# Altium schematic sheet 关键回路分图.SchDoc
size A4
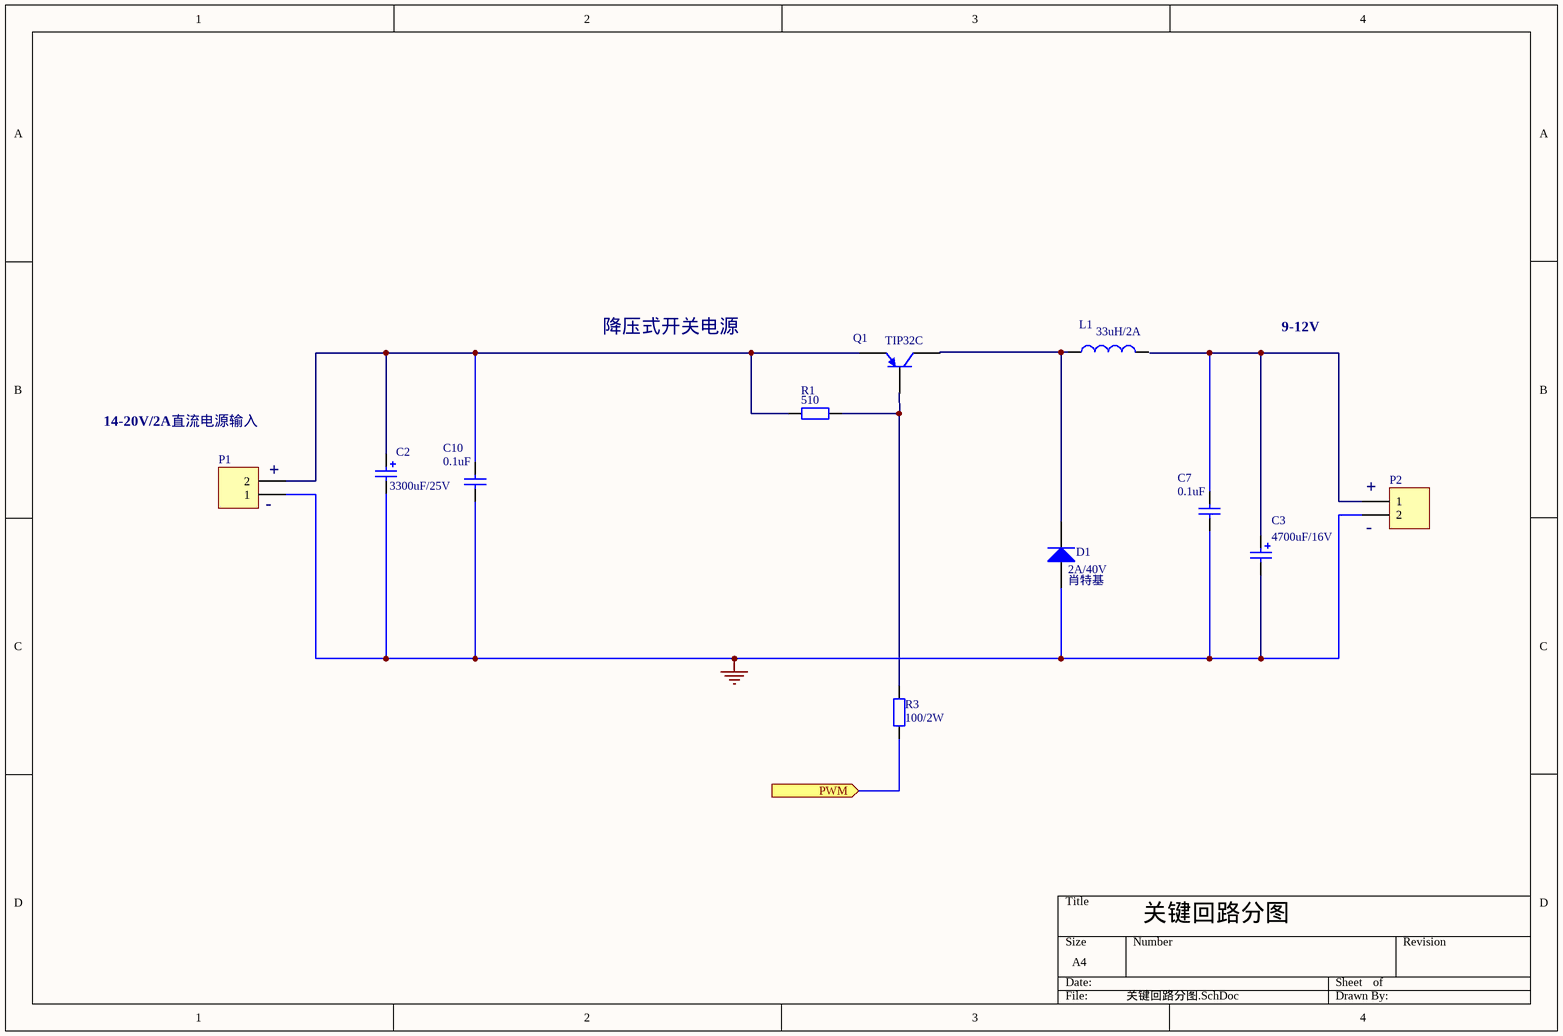
[diagram p0: 关键回路分图.SchDoc]

## Parts
C2  value 3300uF/25V  [3300电解电容]  (hidden comment: Cap Pol2)
C3  value 4700uF/16V  [4700电解电容]  (hidden comment: Cap Pol2)
C7  value 0.1uF  [瓷片电容]  (hidden comment: Cap)
C10  value 0.1uF  [瓷片电容]  (hidden comment: Cap)
D1  2A/40V  [肖特基]
L1  value 33uH/2A  [电感实物]  (hidden comment: Inductor)
P1  Header 2  [HDR1X2]  (value not drawn)
P2  Header 2  [HDR1X2]  (value not drawn)
R1  value 510  [AXIAL-0.4]  (hidden comment: Res2)
R3  value 100/2W  [AXIAL-0.4]  (hidden comment: Res2)
TIP32C  Q1  [TO-220-AB]

## Ports
PWM (in)

## Nets
GND: C2.2 C3.2 C7.1 C10.1 D1.1(A) P1.1 P2.2
PWM: R3.1 ; port PWM
NetC2_1: C2.1 C10.2 P1.2 R1.1 TIP32C.3(E)
NetC3_1: C3.1 C7.2 P2.1
NetD1_2: D1.2(K) L1.1
NetR1_2: R1.2 R3.2

Not connected (* = marked no-connect by the designer): L1 2; TIP32C 1(C) 2(B)

## Notes on the sheet
- 降压式开关电源
- 9-12V
- 14-20V/2A直流电源输入
- (near P1) -
- (near P1) +
- (near P2) +
- (near P2) -
- 关键回路分图

## Library data of the parts
C2 C3 = Cap Pol2: Polarized Capacitor (Axial); Published: 8-Jun-2000; LatestRevisionDate: 17-Jul-2002; LatestRevisionNote: Re-released for DXP Platform.; PackageReference: POLAR0.8; Publisher: Altium Limited
C7 C10 = Cap: Capacitor; Published: 8-Jun-2000; LatestRevisionDate: 17-Jul-2002; LatestRevisionNote: Re-released for DXP Platform.; PackageReference: RAD-0.3; Publisher: Altium Limited; PackageDescription: Radial Cap, Thru-Hole; 2 Leads; 0.3 in Pin Spacing
D1 = Diode: Default Diode; Published: 8-Jun-2000; LatestRevisionDate: 17-Jul-2002; LatestRevisionNote: Re-released for DXP Platform.; PackageVersion: Sep-1996; PackageReference: 肖特基; Publisher: Altium Limited; PackageDescription: DO-214-AB/SMC; 2 C-Bend Leads; Body 7.9 x 5.9 mm, inc. leads (LxW); Code_JEDEC: DO-214-AB
L1 = Inductor: Code_IEC: 1005; Published: 8-Jun-2000; LatestRevisionDate: 29-May-2009; LatestRevisionNote: IPC-7351 Footprint Added.; PackageReference: 0402-A; Publisher: Altium Limited; PackageDescription: Chip Inductor; Code_JEITA: 0402
P1 P2 = Header 2: Header, 2-Pin; LatestRevisionDate: 17-Jul-2002; LatestRevisionNote: Re-released for DXP Platform.; Publisher: Altium Limited
R1 R3 = Res2: Resistor; Published: 8-Jun-2000; LatestRevisionDate: 17-Jul-2002; LatestRevisionNote: Re-released for DXP Platform.; PackageReference: AXIAL-0.4; Publisher: Altium Limited; PackageDescription: Axial Device, Thru-Hole; 2 Leads; 0.4 in Pin Spacing
TIP32C = PNP: PNP Bipolar Transistor; Published: 8-Jun-2000; LatestRevisionDate: 29-May-2009; LatestRevisionNote: IPC-7351 Footprint Added.; PackageVersion: Aug-1999; PackageReference: SOT-23B; Publisher: Altium Limited; PackageDescription: 3-Pin SOT-23 Package 0.95 mm Pitch, 2.4 mm Lead Span